# EAGLE design inc_reg16 (EAGLE 5.09)
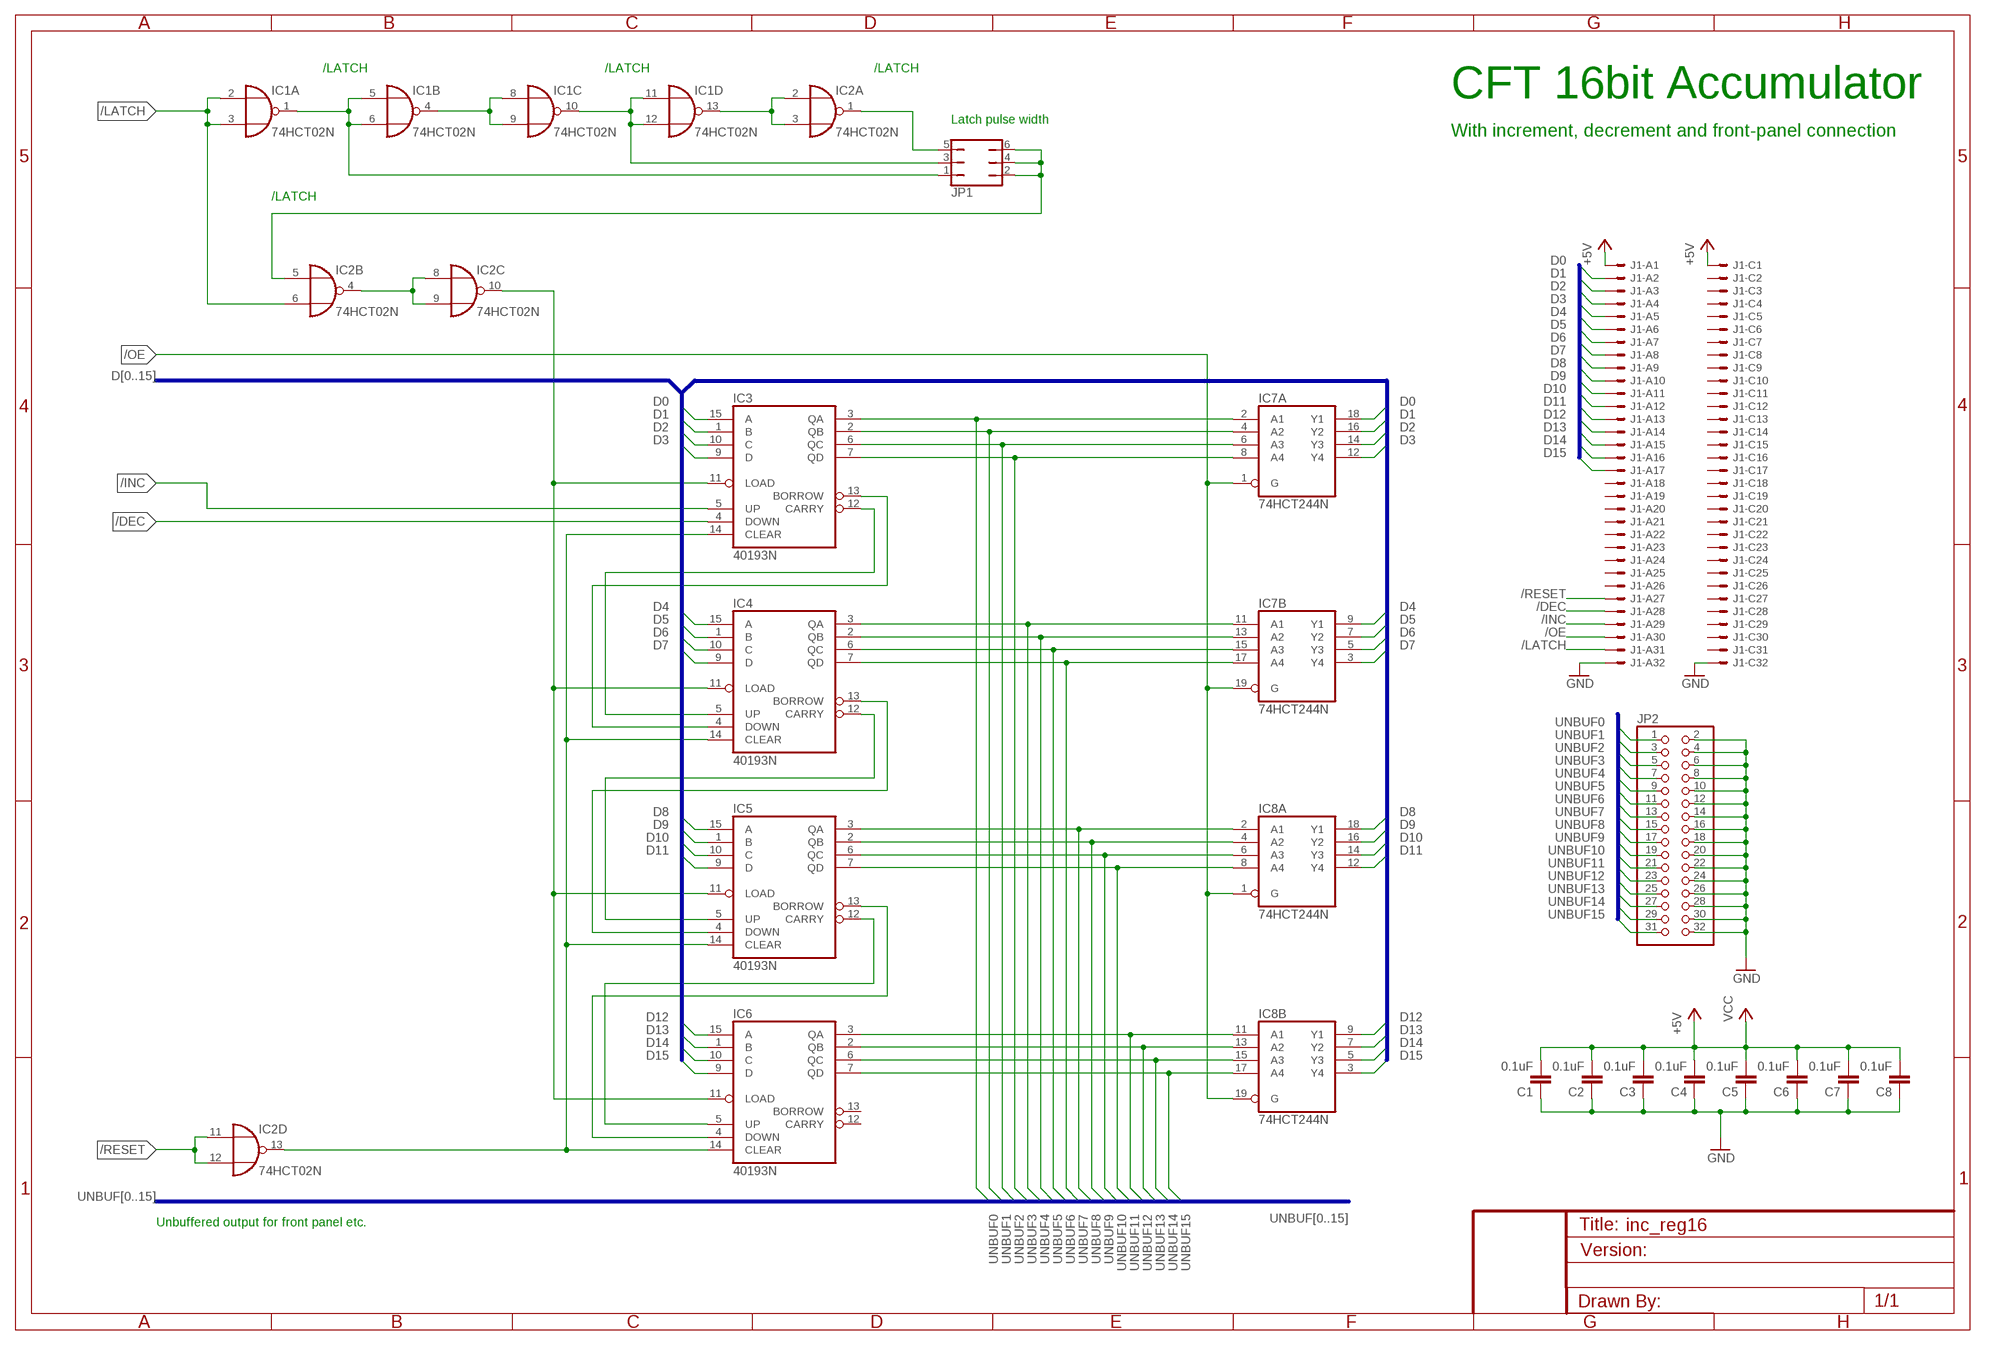
[diagram p0: schematic, sheet 1]

## Parts
C1  0.1uF  C-EU025-024X044  [C025-024X044]
C2  0.1uF  C-EU025-024X044  [C025-024X044]
C3  0.1uF  C-EU025-024X044  [C025-024X044]
C4  0.1uF  C-EU025-024X044  [C025-024X044]
C5  0.1uF  C-EU025-024X044  [C025-024X044]
C6  0.1uF  C-EU025-024X044  [C025-024X044]
C7  0.1uF  C-EU025-024X044  [C025-024X044]
C8  0.1uF  C-EU025-024X044  [C025-024X044]
IC1  74HCT02N  [DIL14]
IC2  74HCT02N  [DIL14]
IC3  40193N  [DIL16]
IC4  40193N  [DIL16]
IC5  40193N  [DIL16]
IC6  40193N  [DIL16]
IC7  74HCT244N  [DIL20]
IC8  74HCT244N  [DIL20]
J1  VG64SB  [VG64B]
JP1  JP3Q  [JP3Q]
JP2  PINHD-2X16/90  [2X16/90]

## Nets
+5V: J1.A1 J1.C1
/DEC: IC3.4(DOWN) J1.A28
/INC: IC3.5(UP) J1.A29
/LATCH: IC1.2(A:I0) IC1.3(A:I1) IC2.6(B:I1) J1.A31
/OE: IC7.1(A:G) IC7.19(B:G) IC8.1(A:G) IC8.19(B:G) J1.A30
/RESET: IC2.11(D:I0) IC2.12(D:I1) J1.A27
D0: IC3.15(A) IC7.18(A:Y1) J1.A2
D1: IC3.1(B) IC7.16(A:Y2) J1.A3
D2: IC3.10(C) IC7.14(A:Y3) J1.A4
D3: IC3.9(D) IC7.12(A:Y4) J1.A5
D4: IC4.15(A) IC7.9(B:Y1) J1.A6
D5: IC4.1(B) IC7.7(B:Y2) J1.A7
D6: IC4.10(C) IC7.5(B:Y3) J1.A8
D7: IC4.9(D) IC7.3(B:Y4) J1.A9
D8: IC5.15(A) IC8.18(A:Y1) J1.A10
D9: IC5.1(B) IC8.16(A:Y2) J1.A11
D10: IC5.10(C) IC8.14(A:Y3) J1.A12
D11: IC5.9(D) IC8.12(A:Y4) J1.A13
D12: IC6.15(A) IC8.9(B:Y1) J1.A14
D13: IC6.1(B) IC8.7(B:Y2) J1.A15
D14: IC6.10(C) IC8.5(B:Y3) J1.A16
D15: IC6.9(D) IC8.3(B:Y4) J1.A17
GND: C1.1 C2.1 C3.1 C4.1 C5.1 C6.1 C7.1 C8.1 J1.A32 J1.C32 JP2.2 JP2.4 JP2.6 JP2.8 JP2.10 JP2.12 JP2.14 JP2.16 JP2.18 JP2.20 JP2.22 JP2.24 JP2.26 JP2.28 JP2.30 JP2.32
N$17: IC1.1(A:O) IC1.5(B:I0) IC1.6(B:I1) JP1.1
N$18: IC1.4(B:O) IC1.8(C:I0) IC1.9(C:I1)
N$19: IC1.10(C:O) IC1.11(D:I0) IC1.12(D:I1) JP1.3
N$20: IC1.13(D:O) IC2.2(A:I0) IC2.3(A:I1)
N$21: IC2.1(A:O) JP1.5
N$22: IC2.5(B:I0) JP1.2 JP1.4 JP1.6
N$23: IC2.4(B:O) IC2.8(C:I0) IC2.9(C:I1)
N$24: IC2.10(C:O) IC3.11(LOAD) IC4.11(LOAD) IC5.11(LOAD) IC6.11(LOAD)
N$25: IC3.12(CARRY) IC4.5(UP)
N$26: IC2.13(D:O) IC3.14(CLEAR) IC4.14(CLEAR) IC5.14(CLEAR) IC6.14(CLEAR)
N$27: IC3.13(BORROW) IC4.4(DOWN)
N$28: IC4.13(BORROW) IC5.4(DOWN)
N$29: IC4.12(CARRY) IC5.5(UP)
N$30: IC5.13(BORROW) IC6.4(DOWN)
N$31: IC5.12(CARRY) IC6.5(UP)
UNBUF0: IC3.3(QA) IC7.2(A:A1) JP2.1
UNBUF1: IC3.2(QB) IC7.4(A:A2) JP2.3
UNBUF2: IC3.6(QC) IC7.6(A:A3) JP2.5
UNBUF3: IC3.7(QD) IC7.8(A:A4) JP2.7
UNBUF4: IC4.3(QA) IC7.11(B:A1) JP2.9
UNBUF5: IC4.2(QB) IC7.13(B:A2) JP2.11
UNBUF6: IC4.6(QC) IC7.15(B:A3) JP2.13
UNBUF7: IC4.7(QD) IC7.17(B:A4) JP2.15
UNBUF8: IC5.3(QA) IC8.2(A:A1) JP2.17
UNBUF9: IC5.2(QB) IC8.4(A:A2) JP2.19
UNBUF10: IC5.6(QC) IC8.6(A:A3) JP2.21
UNBUF11: IC5.7(QD) IC8.8(A:A4) JP2.23
UNBUF12: IC6.3(QA) IC8.11(B:A1) JP2.25
UNBUF13: IC6.2(QB) IC8.13(B:A2) JP2.27
UNBUF14: IC6.6(QC) IC8.15(B:A3) JP2.29
UNBUF15: IC6.7(QD) IC8.17(B:A4) JP2.31
VCC: C1.2 C2.2 C3.2 C4.2 C5.2 C6.2 C7.2 C8.2 ; supply symbol labelled +5V
Unconnected: IC6.12(CARRY) IC6.13(BORROW) J1.A18 J1.A19 J1.A20 J1.A21 J1.A22 J1.A23 J1.A24 J1.A25 J1.A26 J1.C2 J1.C3 J1.C4 J1.C5 J1.C6 J1.C7 J1.C8 J1.C9 J1.C10 J1.C11 J1.C12 J1.C13 J1.C14 J1.C15 J1.C16 J1.C17 J1.C18 J1.C19 J1.C20 J1.C21 J1.C22 J1.C23 J1.C24 J1.C25 J1.C26 J1.C27 J1.C28 J1.C29 J1.C30 J1.C31

## Buses
D[0..15]
UNBUF[0..15]

## Notes on the sheet
- /LATCH | /LATCH | /LATCH
- CFT 16bit Accumulator
- Latch pulse width
- With increment, decrement and front-panel connection
- /LATCH
- Unbuffered output for front panel etc.

## Power pins joined to a net without a drawn wire
GND: IC1.7(P:GND) IC2.7(P:GND) IC7.10(P:GND) IC8.10(P:GND)
VCC: IC1.14(P:VCC) IC2.14(P:VCC) IC7.20(P:VCC) IC8.20(P:VCC)
VDD: IC3.16(VDD) IC4.16(VDD) IC5.16(VDD) IC6.16(VDD)
VSS: IC3.8(VSS) IC4.8(VSS) IC5.8(VSS) IC6.8(VSS)

## Library data of the parts
C1-C8 = rcl:C-EU: CAPACITOR, European symbol
IC1 IC2 = 74xx-eu:74*02: Quad 2-input NOR gate
IC3-IC6 = 40xx:40193: Binary up down COUNTER
IC7 IC8 = 74xx-eu:74*244: Octal BUFFER and LINE DRIVER, 3-state
J1 = 19inch:VG64S: PCB EUROCARD, 64-pin type C/AC, 2.54 mm
JP1 = jumper:JP3Q: JUMPER
JP2 = pinhead:PINHD-2X16: PIN HEADER

## Board
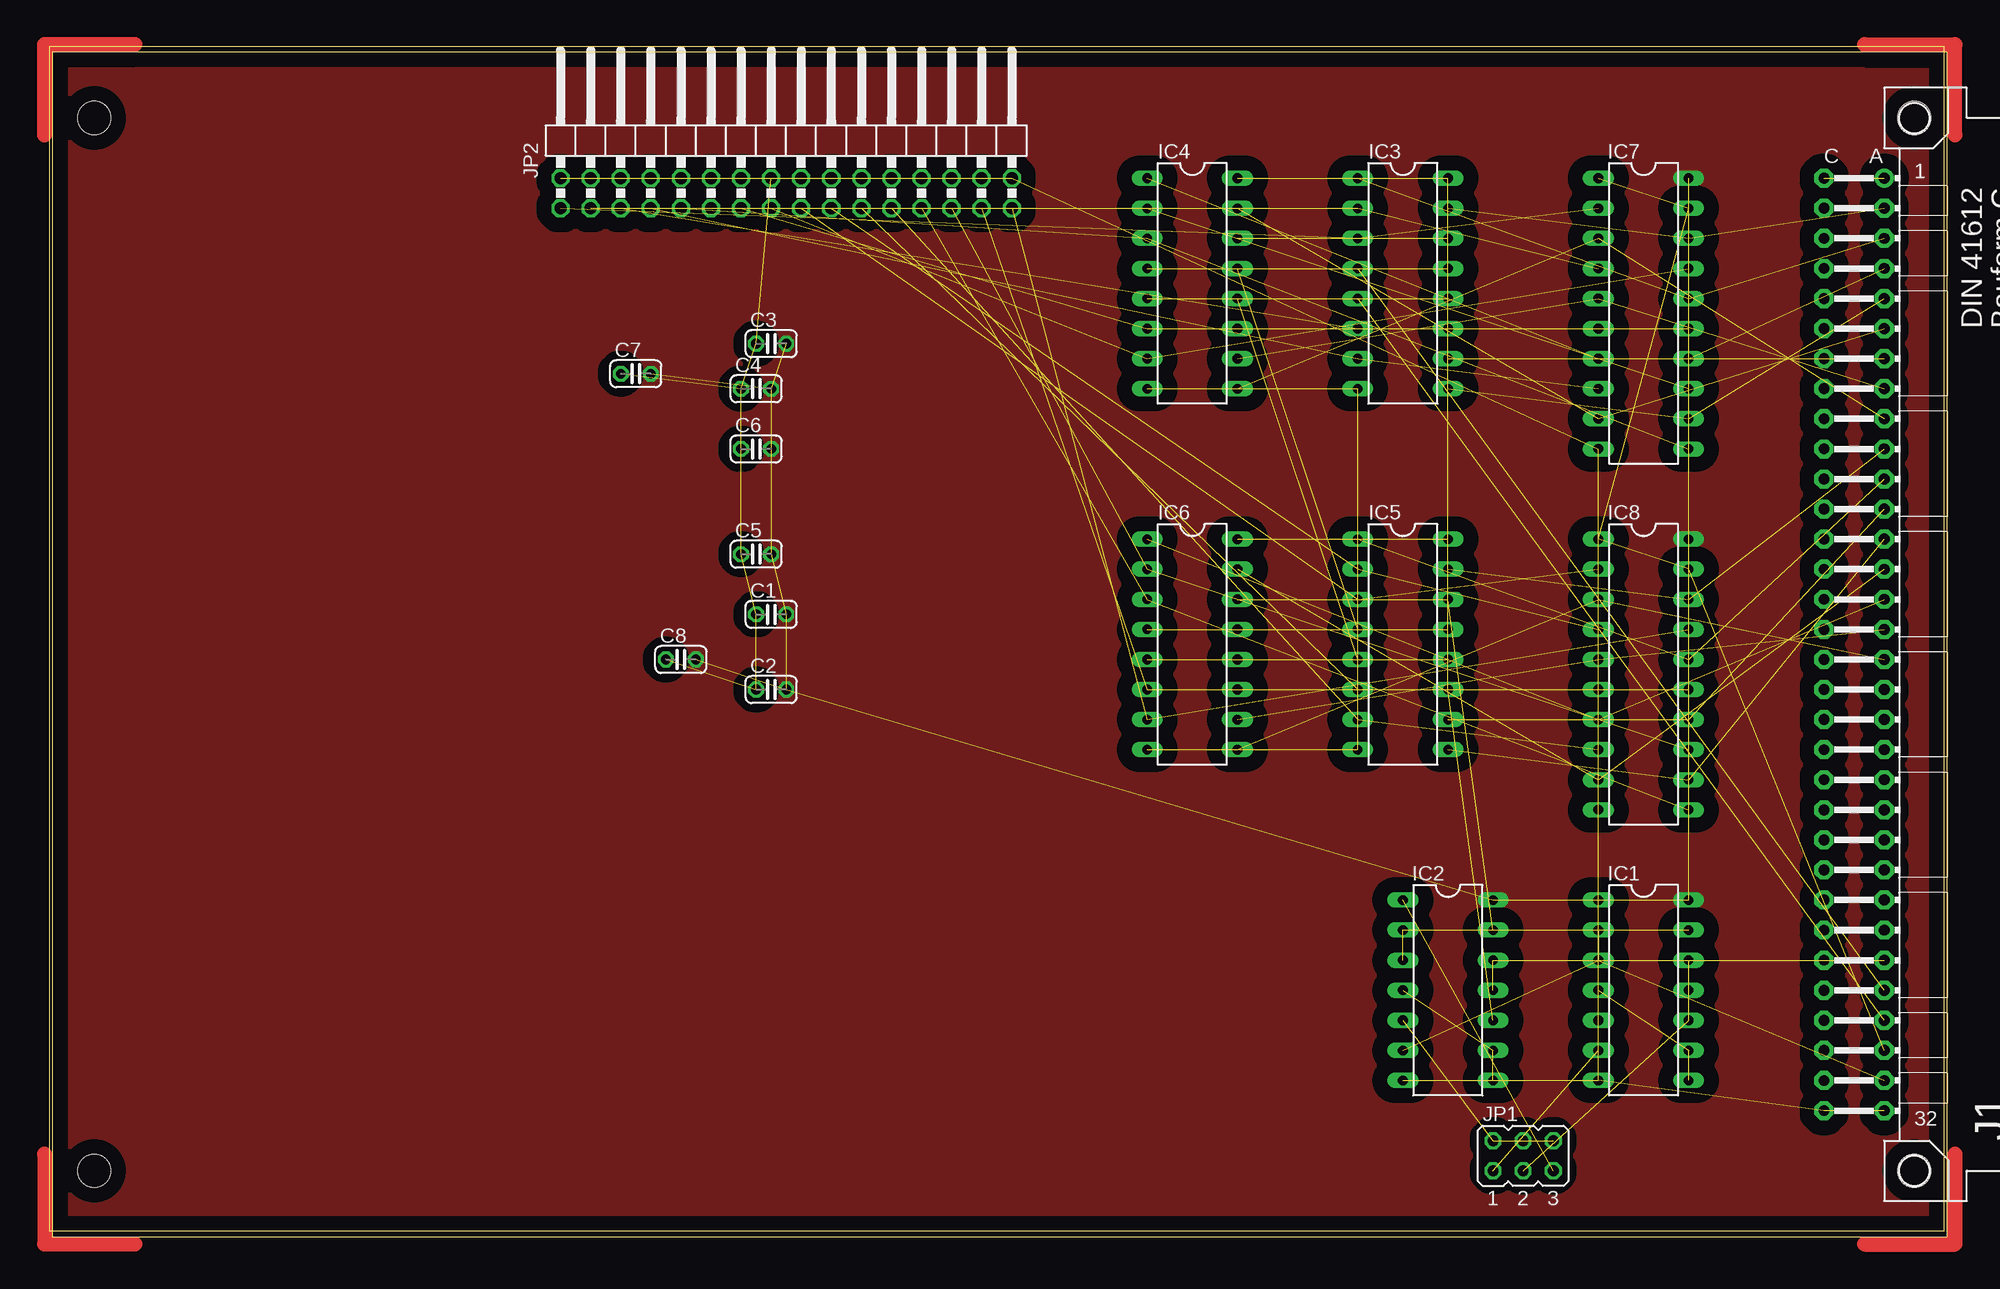
[diagram p1: board, top side]
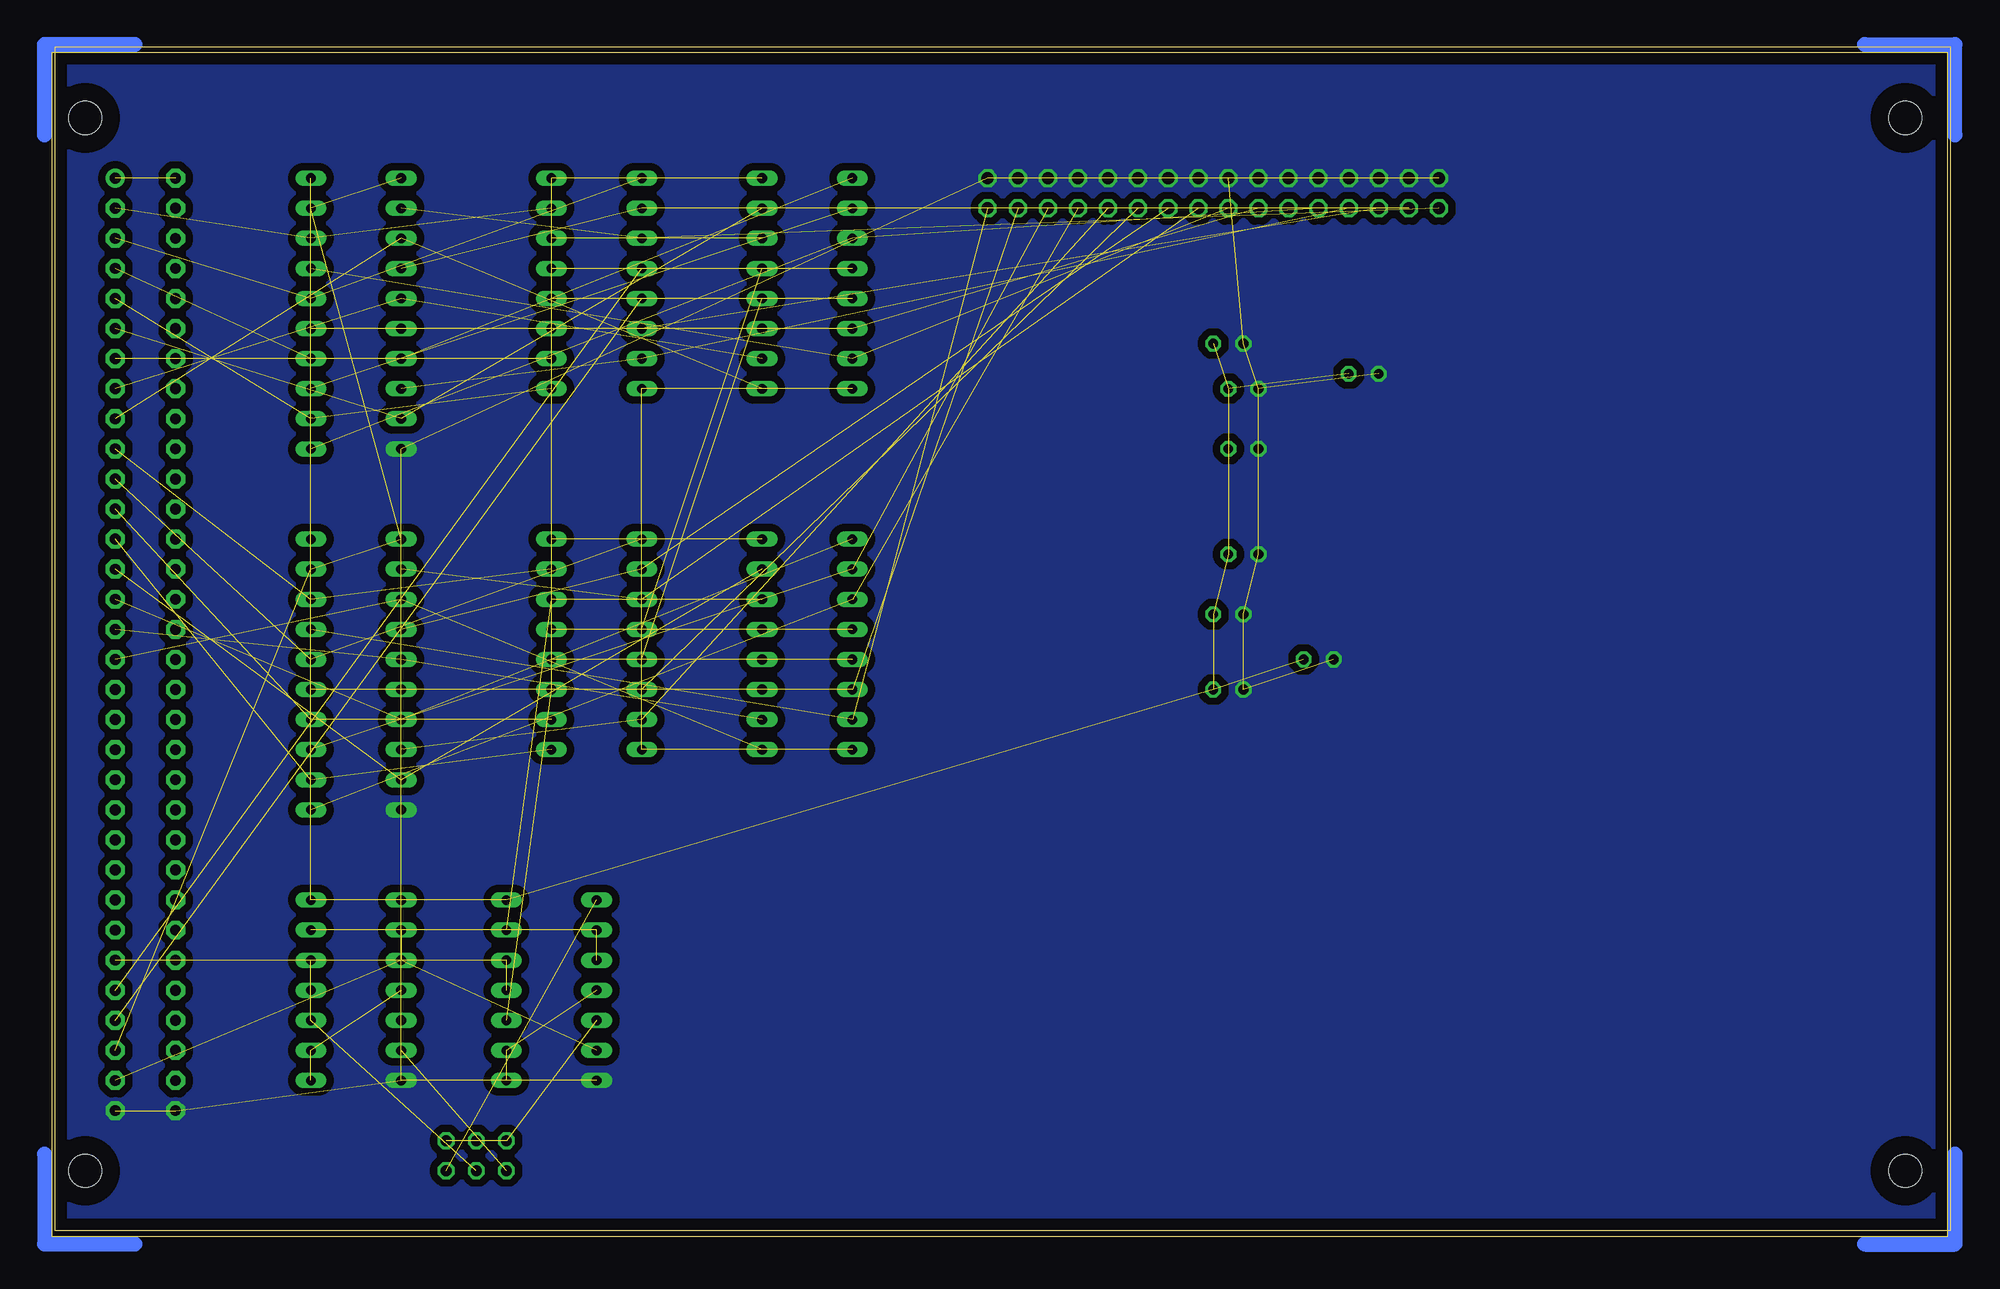
[diagram p2: board, bottom side, seen from below]

Size 160 x 100 mm. Coordinates in mm from the lower left corner, seen from the top.
Outline: 0,0 160,0 160,100 0,100 0,0
Copper layers (1*16): Top 0.035mm / dielectric 1.5mm / Bottom 0.035mm
Design rules "default": minimum track width 10mil, minimum drill 24mil, track to track 8mil, track to pad 8mil, pad to pad 8mil, via to via 8mil, smd to smd 8mil, copper to edge 40mil, drill to drill 8mil, minimum pad ring 10mil, minimum via ring 8mil, stop-mask expansion 4mil, vias tented up to drill 0mil, thermal gap 10mil

### Footprints (pad centres in the part's own frame; a part is rotated, then mirrored left to right if it is on the bottom)
C025-024X044 = drill 0.813 octagon: 1 -1.27,0; 2 1.27,0
DIL14 = drill 0.813 long: 1 -7.62,-3.81; 2 -5.08,-3.81; 3 -2.54,-3.81; 4 0,-3.81; 5 2.54,-3.81; 6 5.08,-3.81; 7 7.62,-3.81; 8 7.62,3.81; 9 5.08,3.81; 10 2.54,3.81; 11 0,3.81; 12 -2.54,3.81; 13 -5.08,3.81; 14 -7.62,3.81
DIL16 = drill 0.813 long: 1 -8.89,-3.81; 2 -6.35,-3.81; 3 -3.81,-3.81; 4 -1.27,-3.81; 5 1.27,-3.81; 6 3.81,-3.81; 7 6.35,-3.81; 8 8.89,-3.81; 9 8.89,3.81; 10 6.35,3.81; 11 3.81,3.81; 12 1.27,3.81; 13 -1.27,3.81; 14 -3.81,3.81; 15 -6.35,3.81; 16 -8.89,3.81
DIL20 = drill 0.813 long: 1 -11.43,-3.81; 2 -8.89,-3.81; 3 -6.35,-3.81; 4 -3.81,-3.81; 5 -1.27,-3.81; 6 1.27,-3.81; 7 3.81,-3.81; 8 6.35,-3.81; 9 8.89,-3.81; 10 11.43,-3.81; 11 11.43,3.81; 12 8.89,3.81; 13 6.35,3.81; 14 3.81,3.81; 15 1.27,3.81; 16 -1.27,3.81; 17 -3.81,3.81; 18 -6.35,3.81; 19 -8.89,3.81; 20 -11.43,3.81
VG64B = drill 0.914 pad 1.6 round: A1 154.94,39.37 | drill 0.914 pad 1.6 octagon: A2 154.94,36.83; A3 154.94,34.29; A4 154.94,31.75; A5 154.94,29.21; A6 154.94,26.67; A7 154.94,24.13; A8 154.94,21.59; A9 154.94,19.05; A10 154.94,16.51; A11 154.94,13.97; A12 154.94,11.43; A13 154.94,8.89; A14 154.94,6.35; A15 154.94,3.81; A16 154.94,1.27; A17 154.94,-1.27; A18 154.94,-3.81; A19 154.94,-6.35; A20 154.94,-8.89; A21 154.94,-11.43; A22 154.94,-13.97; A23 154.94,-16.51; A24 154.94,-19.05; A25 154.94,-21.59; A26 154.94,-24.13; A27 154.94,-26.67; A28 154.94,-29.21; A29 154.94,-31.75; A30 154.94,-34.29; A31 154.94,-36.83; A32 154.94,-39.37; C1 149.86,39.37; C2 149.86,36.83; C3 149.86,34.29; C4 149.86,31.75; C5 149.86,29.21; C6 149.86,26.67; C7 149.86,24.13; C8 149.86,21.59; C9 149.86,19.05; C10 149.86,16.51; C11 149.86,13.97; C12 149.86,11.43; C13 149.86,8.89; C14 149.86,6.35; C15 149.86,3.81; C16 149.86,1.27; C17 149.86,-1.27; C18 149.86,-3.81; C19 149.86,-6.35; C20 149.86,-8.89; C21 149.86,-11.43; C22 149.86,-13.97; C23 149.86,-16.51; C24 149.86,-19.05; C25 149.86,-21.59; C26 149.86,-24.13; C27 149.86,-26.67; C28 149.86,-29.21; C29 149.86,-31.75; C30 149.86,-34.29; C31 149.86,-36.83; C32 149.86,-39.37 | hole 2.794: 157.48,44.45; 157.48,-44.45; 3.81,-44.45; 3.81,44.45
JP3Q = drill 0.914 octagon: 1 -2.54,-1.27; 2 -2.54,1.27; 3 0,-1.27; 4 0,1.27; 5 2.54,-1.27; 6 2.54,1.27
2X16/90 = drill 1.016 octagon: 1 -19.05,-6.35; 2 -19.05,-3.81; 3 -16.51,-6.35; 4 -16.51,-3.81; 5 -13.97,-6.35; 6 -13.97,-3.81; 7 -11.43,-6.35; 8 -11.43,-3.81; 9 -8.89,-6.35; 10 -8.89,-3.81; 11 -6.35,-6.35; 12 -6.35,-3.81; 13 -3.81,-6.35; 14 -3.81,-3.81; 15 -1.27,-6.35; 16 -1.27,-3.81; 17 1.27,-6.35; 18 1.27,-3.81; 19 3.81,-6.35; 20 3.81,-3.81; 21 6.35,-6.35; 22 6.35,-3.81; 23 8.89,-6.35; 24 8.89,-3.81; 25 11.43,-6.35; 26 11.43,-3.81; 27 13.97,-6.35; 28 13.97,-3.81; 29 16.51,-6.35; 30 16.51,-3.81; 31 19.05,-6.35; 32 19.05,-3.81

### Placement (x,y rotation side)
C1  60.96,52.07 0 top
C2  60.96,45.72 0 top
C3  60.96,74.93 0 top
C4  59.69,71.12 0 top
C5  59.69,57.15 0 top
C6  59.69,66.04 0 top
C7  49.53,72.39 0 top
C8  53.34,48.26 0 top
IC1  134.62,20.32 270 top
IC2  118.11,20.32 270 top
IC3  114.3,80.01 270 top
IC4  96.52,80.01 270 top
IC5  114.3,49.53 270 top
IC6  96.52,49.53 270 top
IC7  134.62,77.47 270 top
IC8  134.62,46.99 270 top
J1  0,49.53 0 top
JP1  124.46,6.35 0 top
JP2  62.23,92.71 0 top

### Tracks (layer width: path | path; a pad name or v marks a point on that pad's centre or on a via)
+5V  (1 unrouted)
/DEC  (1 unrouted)
/INC  (1 unrouted)
/LATCH  (3 unrouted)
/OE  (4 unrouted)
/RESET  (2 unrouted)
D0  (2 unrouted)
D1  (2 unrouted)
D2  (2 unrouted)
D3  (2 unrouted)
D4  (2 unrouted)
D5  (2 unrouted)
D6  (2 unrouted)
D7  (2 unrouted)
D8  (2 unrouted)
D9  (2 unrouted)
D10  (2 unrouted)
D11  (2 unrouted)
D12  (2 unrouted)
D13  (2 unrouted)
D14  (2 unrouted)
D15  (2 unrouted)
GND  (29 unrouted)
  pour Bottom (isolate 0.635, no thermals): 0,99.06 0,0 160.02,0 160.02,99.06
N$17  (3 unrouted)
N$18  (2 unrouted)
N$19  (3 unrouted)
N$20  (2 unrouted)
N$21  (1 unrouted)
N$22  (3 unrouted)
N$23  (2 unrouted)
N$24  (4 unrouted)
N$25  (1 unrouted)
N$26  (4 unrouted)
N$27  (1 unrouted)
N$28  (1 unrouted)
N$29  (1 unrouted)
N$30  (1 unrouted)
N$31  (1 unrouted)
UNBUF0  (2 unrouted)
UNBUF1  (2 unrouted)
UNBUF2  (2 unrouted)
UNBUF3  (2 unrouted)
UNBUF4  (2 unrouted)
UNBUF5  (2 unrouted)
UNBUF6  (2 unrouted)
UNBUF7  (2 unrouted)
UNBUF8  (2 unrouted)
UNBUF9  (2 unrouted)
UNBUF10  (2 unrouted)
UNBUF11  (2 unrouted)
UNBUF12  (2 unrouted)
UNBUF13  (2 unrouted)
UNBUF14  (2 unrouted)
UNBUF15  (2 unrouted)
VCC  (11 unrouted)
  pour Top (isolate 1.27, no thermals): 1.27,99.06 1.27,0 160.02,0 160.02,99.06
VDD  (3 unrouted)
VSS  (3 unrouted)